# Altium schematic sheet Mechanical.SchDoc
size A4; SheetNumber: 13; SheetTotal: 13
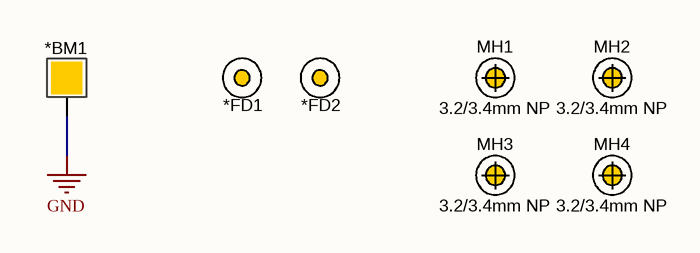
[diagram p0: Mechanical.SchDoc]

## Parts
*BM1  BADMARK  [BADMARK_BIG]  (value not drawn)
*FD1  FIDUCIAL  [FIDUCIAL]  (value not drawn)
*FD2  FIDUCIAL  [FIDUCIAL]  (value not drawn)
MH1  3.2/3.4mm NP  [TH_MH3.2/3.4NP]  (no BOM)
MH2  3.2/3.4mm NP  [TH_MH3.2/3.4NP]  (no BOM)
MH3  3.2/3.4mm NP  [TH_MH3.2/3.4NP]  (no BOM)
MH4  3.2/3.4mm NP  [TH_MH3.2/3.4NP]  (no BOM)

## Nets
GND: *BM1.1

Not connected (* = marked no-connect by the designer): *FD1 1; *FD2 1

## Notes on the sheet
- Title:
- Date:
- Project:
- Type:
- Schematic
- Variant:
- Revision:
- Sheet
- of
- Author:
- Evžen Šteif
- Size:
- A4

## Library data of the parts
*BM1 = MCH_00111: Manufacturer: LE; Autor: JA; Designer: Krahulec; Active: 1; Sourcing: None; Generic_replacement: No; Count: 0; LE_Price: 0.000000; LastRevisionDate: 14.5.2018; LastRevisionSvnBuild: *; Value: BADMARK; PartNumber: MCH_00111; Technology: NOP; Librarian: Krahulec; ComponentLink1URL: http://www.logicelements.cz; ComponentLink1Description: Manufacturer Web; Cat1: Badmark; ROHS: 1; Jablotron_Price: 0; Location: LE
*FD1 *FD2 = MCH_00028: Autor: Lukas Krahulec; Jablotron_Price: 0; Location: LE; Active: 1; Temperature_Min: -55; Temperature_Max: 125; TemperatureRange: Military; Sourcing: None; Generic_replacement: No; LatestRevisionDate: 25.6.2018; Value: Fiducial; PartNumber: MCH_00028; LE_Price: 0; Technology: NOP; Designer: Lukas Krahulec; Librarian: Lukas Krahulec; Manufacturer: LE; FIT: 0; ComponentLink1URL: http://www.logicelements.cz; ComponentLink1Description: Manufacturer Web; Cat1: Fiducial; ROHS: 1; Storage_Count: 0
MH1-MH4 = MCH_00037: (Mount Hole 3.2mm); Autor: Lukas Krahulec; Jablotron_Price: 0; Location: LE; Active: 1; Temperature_Min: -55; Temperature_Max: 125; TemperatureRange: Military; Cat1: Mounting Holes; Cat2: Non-Plated; Sourcing: None; Generic_replacement: No; LatestRevisionDate: 24.2.2020; Value: 3.2/3.4mm NP; PartNumber: MCH_00037; LE_Price: 0; Technology: NOP; Designer: Lukas Krahulec; Librarian: Lukas Krahulec; Manufacturer: LE; FIT: 0; ComponentLink1URL: http://www.logicelements.cz; ComponentLink1Description: Manufacturer Web; Cat3: 3.2 mm; ROHS: 1; Storage_Count: 0